# Altium schematic sheet Э2 Jinkono Module Схема электрическая функциональная.SchDoc
size 420 x 297 mm; Author: Гавриленко; CompanyName: OPEN SOURCE; Address1: Address1; Address2: Address2; Address3: Address3; Address4: Address4; SheetTotal: 1; DocumentType: Схема электрическая принципиальная
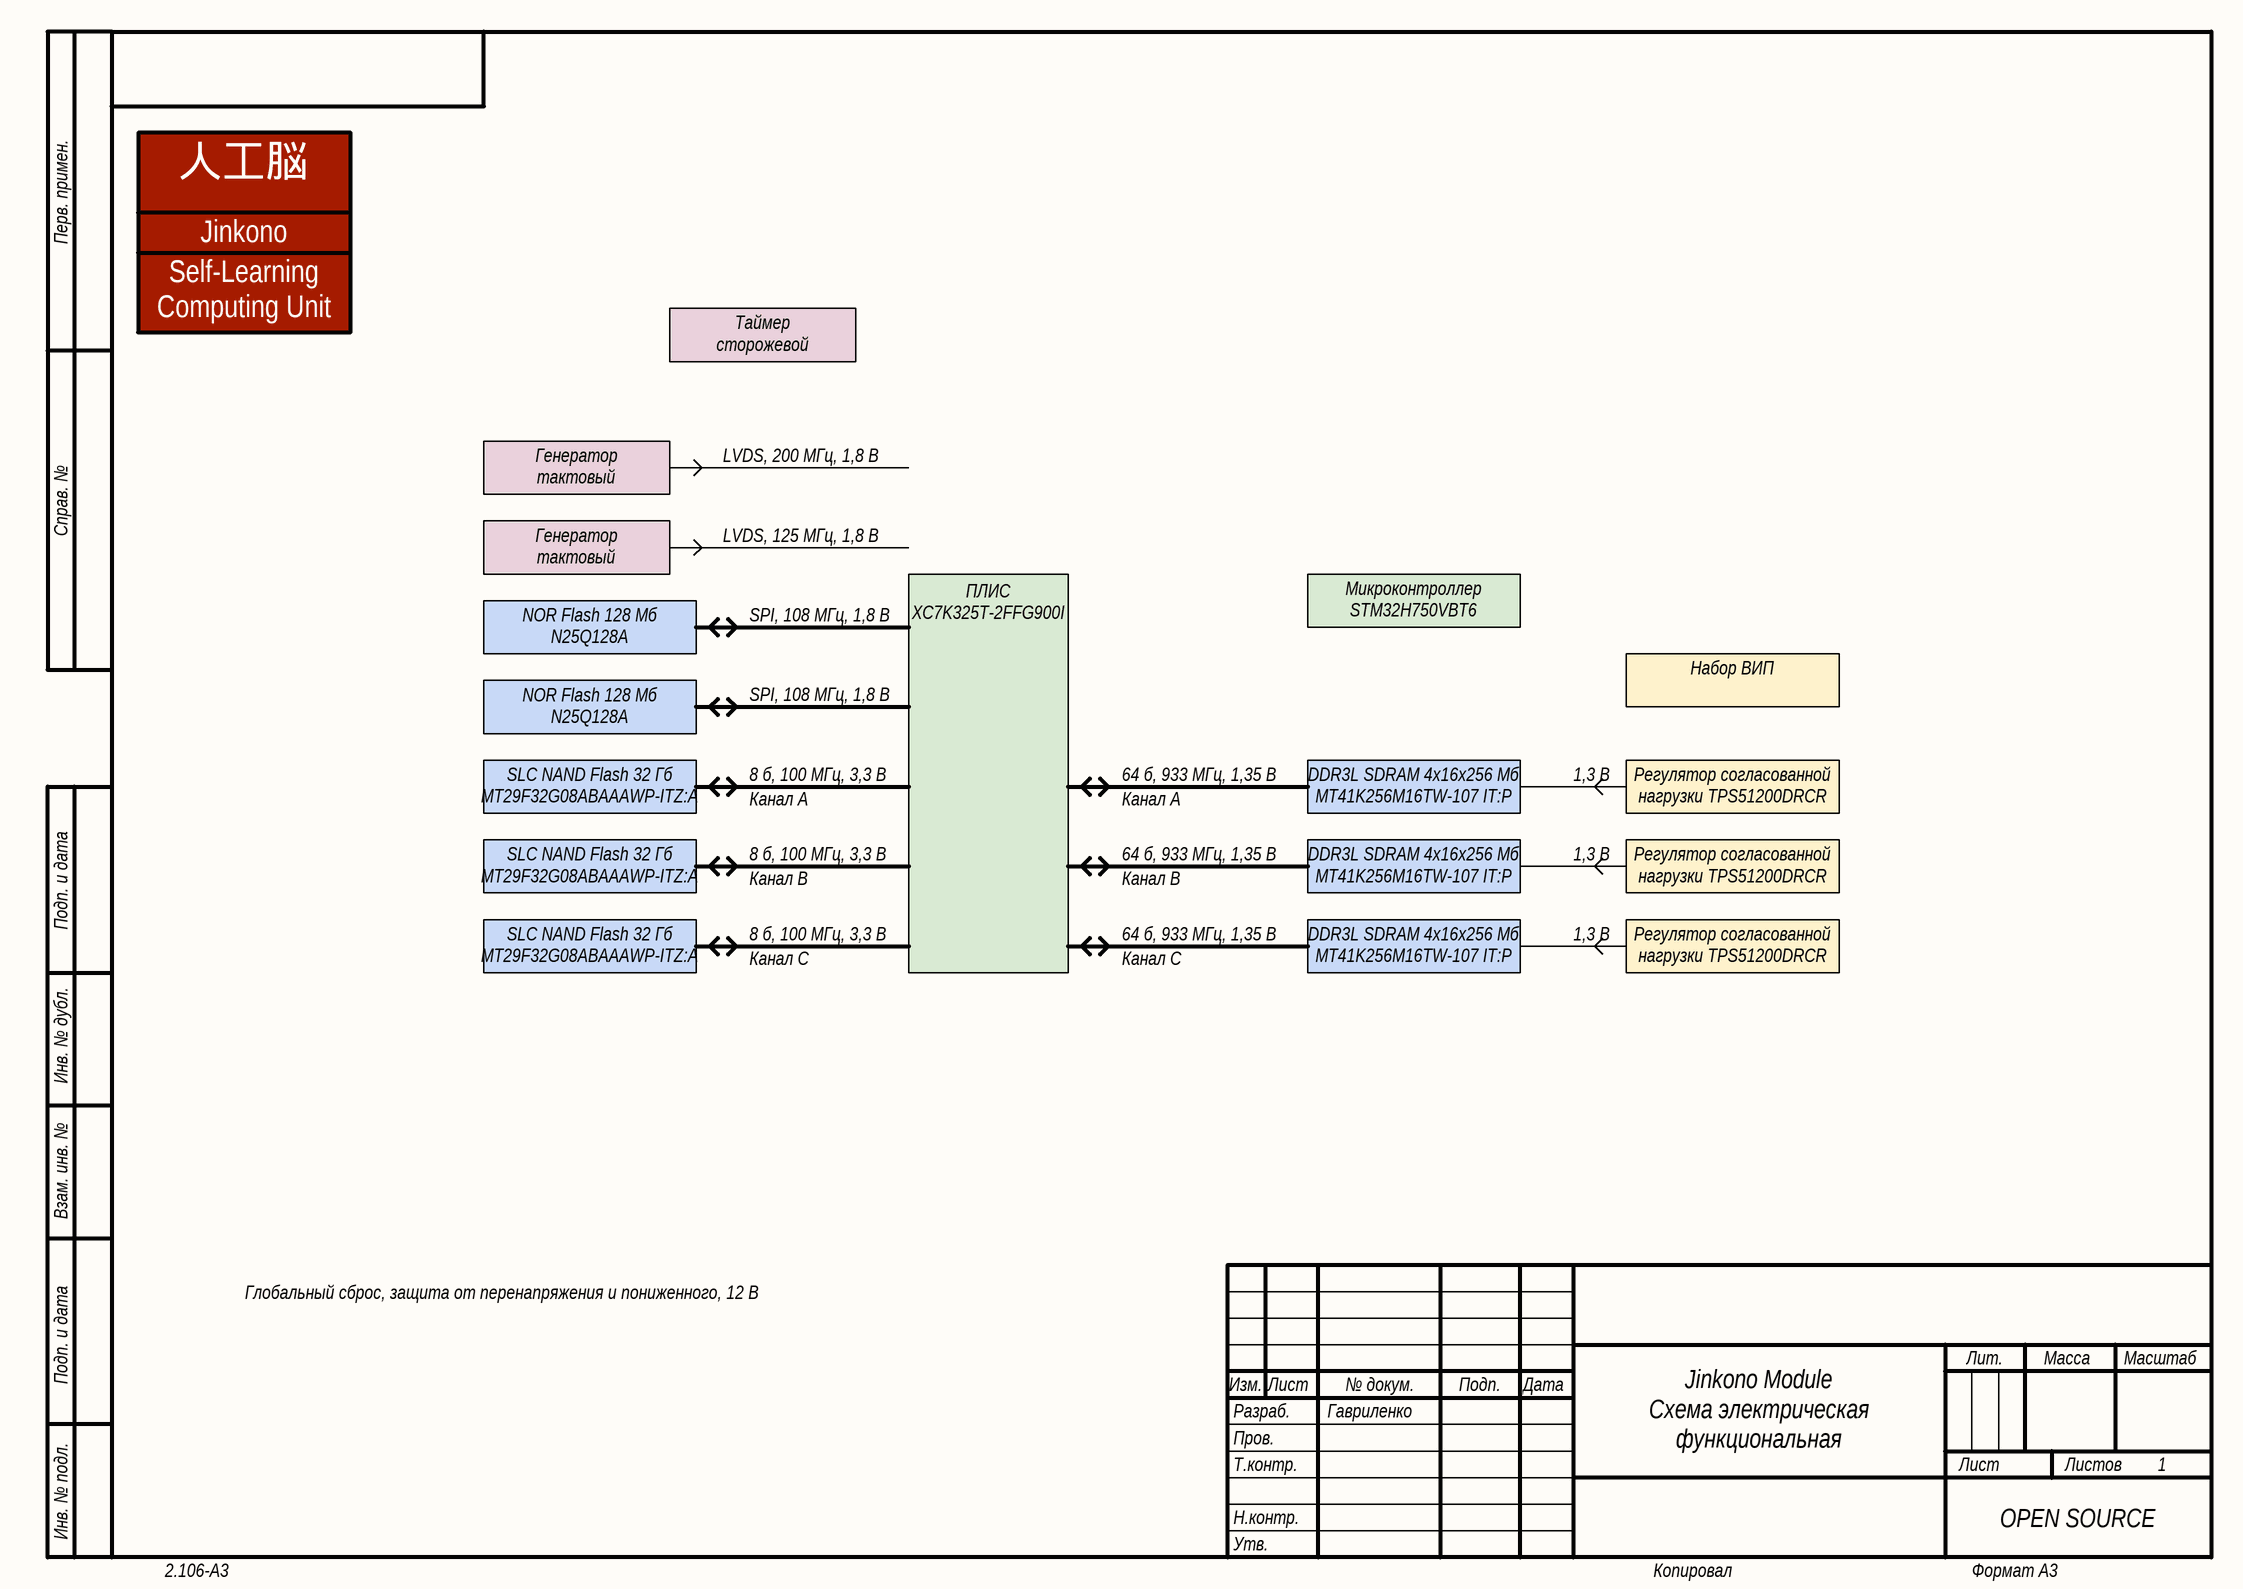
[diagram p0: Э2 Jinkono Module Схема электрическая функциональная.SchDoc]

## Notes on the sheet
- 人工脳
- Jinkono
- Self-Learning
  Computing Unit
- Таймер
  сторожевой
- LVDS, 200 МГц, 1,8 В
- Генератор
  тактовый
- LVDS, 125 МГц, 1,8 В
- NOR Flash 128 Mб
  N25Q128A
- SPI, 108 МГц, 1,8 В
- Микроконтроллер
  STM32H750VBT6
- Набор ВИП
- 8 б, 100 МГц, 3,3 В
- Канал A
- 64 б, 933 МГц, 1,35 В
- 1,3 В
- SLC NAND Flash 32 Гб
  MT29F32G08ABAAAWP-ITZ:A
- Канал B
- DDR3L SDRAM 4x16x256 Мб
  MT41K256M16TW-107 IT:P
- Регулятор согласованной
  нагрузки TPS51200DRCR
- Канал C
- ПЛИС
  XC7K325T-2FFG900I
- Глобальный сброс, защита от перенапряжения и пониженного, 12 В
- Jinkono Module
  Схема электрическая
  функциональная
- OPEN SOURCE
- Перв. примен.
- Справ. №
- Подп. и дата
- Инв. № дубл.
- Взам. инв. №
- Разраб.
- Изм.
- Лист
- № докум.
- Подп.
- Дата
- Лит.
- Масса
- Масштаб
- Пров.
- Т.контр.
- Листов
- Инв. № подл.
- Утв.
- Н.контр.
- 2.106-A3
- Копировал
- Формат А3